# Altium schematic sheet Frequency Meter.SchDoc
size B; PART_NAME: 2S200-PQ208-5; Organization: Altium Limited; Address1: L3, 12a Rodborough Rd; Address2: Frenchs Forest; Address3: NSW; Address4: Australia 2086; DocumentNumber: 1; SheetNumber: 1; SheetTotal: 4
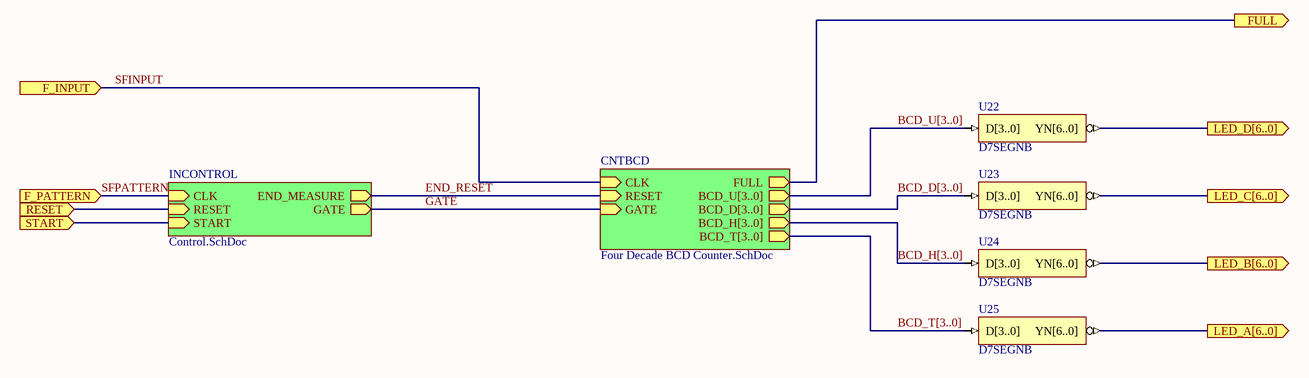
[diagram p0: Frequency Meter.SchDoc]

## Parts
U22  D7SEGNB
U23  D7SEGNB
U24  D7SEGNB
U25  D7SEGNB

## Sub-sheets
CNTBCD = Four Decade BCD Counter.SchDoc: CLK (in), RESET (in), GATE (in), FULL (out), BCD_D[3..0] (out), BCD_U[3..0] (out), BCD_H[3..0] (out), BCD_T[3..0] (out)
INCONTROL = Control.SchDoc: CLK (in), RESET (in), START (in), END_MEASURE (out), GATE (out)

## Ports
F_INPUT (in), F_PATTERN (in), FULL (out), LED_A[6..0] (out), LED_B[6..0] (out), LED_C[6..0] (out), LED_D[6..0] (out), RESET (in), START (in)

## Nets
BCD_D[3..0]: U23.D[3..0] ; sheet CNTBCD/BCD_D[3..0]
BCD_H[3..0]: U24.D[3..0] ; sheet CNTBCD/BCD_H[3..0]
BCD_T[3..0]: U25.D[3..0] ; sheet CNTBCD/BCD_T[3..0]
BCD_U[3..0]: U22.D[3..0] ; sheet CNTBCD/BCD_U[3..0]
END_RESET: sheet INCONTROL/END_MEASURE, sheet CNTBCD/RESET
FULL: port FULL, sheet CNTBCD/FULL
GATE: sheet INCONTROL/GATE, sheet CNTBCD/GATE
LED_A[6..0]: U25.YN[6..0] ; port LED_A[6..0]
LED_B[6..0]: U24.YN[6..0] ; port LED_B[6..0]
LED_C[6..0]: U23.YN[6..0] ; port LED_C[6..0]
LED_D[6..0]: U22.YN[6..0] ; port LED_D[6..0]
RESET: port RESET, sheet INCONTROL/RESET
SFINPUT: port F_INPUT, sheet CNTBCD/CLK
SFPATTERN: port F_PATTERN, sheet INCONTROL/CLK
START: port START, sheet INCONTROL/START

## Buses and harness runs
bus BCD_D[3..0] = sheet CNTBCD/BCD_D[3..0]
bus BCD_H[3..0] = sheet CNTBCD/BCD_H[3..0]
bus BCD_T[3..0] = sheet CNTBCD/BCD_T[3..0]
bus BCD_U[3..0] = sheet CNTBCD/BCD_U[3..0]

## Notes on the sheet
- Title
- Size:
- Date:
- B
- Number:
- Time:
- Revision:
- Sheet
- of
- File:

## Library data of the parts
U22-U25 = D7SEGNB: 7-Segment-Display Decoder for Common-Anode LED (Active Low Output), Bus Version; ArchiveName: GENERIC; VHDLIB_SIM: GENERIC_LIB; Published: 29-Jan-2004; Publisher: Altium Limited; Core Revision: 1.00.00